# Altium project Testpoints.PrjPcb
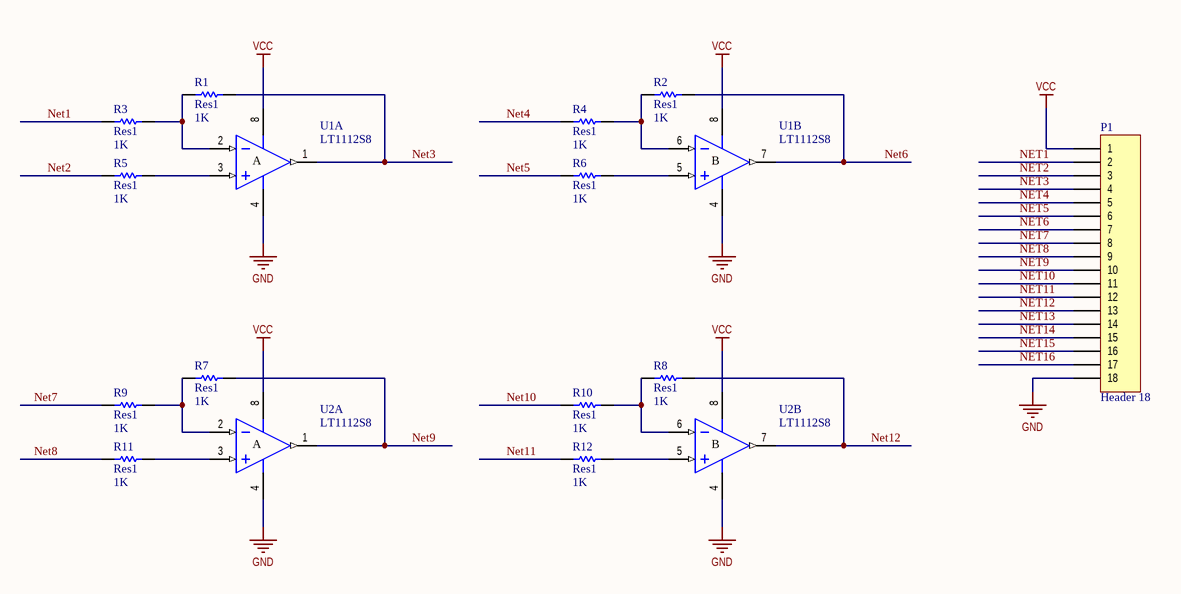
[diagram p0: Testpoints.SchDoc]
1 sheet, 15 parts. Net scope: global (net labels, ports and power ports of the same name join across sheets).
Board file: Testpoints.PcbDoc

## Sheet Testpoints.SchDoc: Testpoints
size 431 x 279 mm

### Parts
P1  Header 18  [HDR1X18]
R1  Res1  value 1K  [AXIAL-0.3]
R2  Res1  value 1K  [AXIAL-0.3]
R3  Res1  value 1K  [AXIAL-0.3]
R4  Res1  value 1K  [AXIAL-0.3]
R5  Res1  value 1K  [AXIAL-0.3]
R6  Res1  value 1K  [AXIAL-0.3]
R7  Res1  value 1K  [AXIAL-0.3]
R8  Res1  value 1K  [AXIAL-0.3]
R9  Res1  value 1K  [AXIAL-0.3]
R10  Res1  value 1K  [AXIAL-0.3]
R11  Res1  value 1K  [AXIAL-0.3]
R12  Res1  value 1K  [AXIAL-0.3]
U1  LT1112S8  [S8_N]  (parts A,B of 2)
U2  LT1112S8  [S8_N]  (parts A,B of 2)

### Nets
GND: P1.18 U1.4(V-) U2.4(V-)
VCC: P1.1 U1.8(V+) U2.8(V+)
Net1: P1.2 R3.1
Net2: P1.3 R5.1
Net3: P1.4 R1.2 U1.1(OUT)
Net4: P1.5 R4.1
Net5: P1.6 R6.1
Net6: P1.7 R2.2 U1.7(OUT)
Net7: P1.8 R9.1
Net8: P1.9 R11.1
Net9: P1.10 R7.2 U2.1(OUT)
Net10: P1.11 R10.1
Net11: P1.12 R12.1
Net12: P1.13 R8.2 U2.7(OUT)
NET13: P1.14
NET14: P1.15
NET15: P1.16
NET16: P1.17
NetR1_1: R1.1 R3.2 U1.2(IN-)
NetR2_1: R2.1 R4.2 U1.6(IN-)
NetR5_2: R5.2 U1.3(IN+)
NetR6_2: R6.2 U1.5(IN+)
NetR7_1: R7.1 R9.2 U2.2(IN-)
NetR8_1: R8.1 R10.2 U2.6(IN-)
NetR11_2: R11.2 U2.3(IN+)
NetR12_2: R12.2 U2.5(IN+)

### Notes on the sheet
- 8
- 7
- 6
- 5
- 4
- 3
- DWG. NO.
- REV.
- SHT.
- 2
- 1
- THIS DOCUMENT AND THE DATA DISCLOSED HEREIN OR HEREWITH IS THE PROPERTY OF ALTIUM LIMITED AND MAY BE FREELY DISTRIBUTED IN WHOLE. NO RIGHTS ARE RESERVED OR EXPRESS OR IMPLIED WARANTEE GIVEN.
- REVISION
- DESCRIPTION
- DATE
- APPROVED
- F
- E
- D
- C
- B
- ENG:
- APPROVALS
- PROJECT
- A
- DSN:
- CHK:
- REFERENCE DOCUMENTS
- PROJECT REVISION:
- TITLE
- DOCUMENT REVISION:
- DESIGN ITEM:
- BOM:
- FAB DWG:
- PCB DWG:
- ASSY DWG:
- SCALE:
- SIZE
- CAGE CODE
- FILE NAME
- DWG NO.
- SHEET
- OF
- REV
- (in symbol LT1112S8, part A) A
- (in symbol LT1112S8, part B) B

### Library data of the parts
P1 = Header 18: Header, 18-Pin; LatestRevisionDate: 17-Jul-2002; LatestRevisionNote: Re-released for DXP Platform.; Publisher: Altium Limited
R1-R12 = Res1: Resistor; Published: 8-Jun-2000; LatestRevisionDate: 17-Jul-2002; LatestRevisionNote: Re-released for DXP Platform.; PackageReference: AXIAL-0.3; Publisher: Altium Limited; PackageDescription: Axial Device, Thru-Hole; 2 Leads; 0.3 in Pin Spacing
U1 U2 = LT1112S8: Dual Low Power Precision, Picoamp Input Operational Amplifier; Note: 462; Published: 8-Jun-2000; LatestRevisionDate: 13-Apr-2006; LatestRevisionNote: IPC-7351 Footprint Added.; DatasheetVersion: 1996; PackageReference: S8; Publisher: Altium Limited; PackageDescription: 8-Pin Small Outline Integrated Circuit 1.27 mm Pitch; Code_JEDEC: MS-012-AA; Code_IPC: SOIC127P600-8; ComponentLink1Description: Manufacturer Link; ComponentLink1URL: http://www.linear.com/; ComponentLink2Description: Datasheet; ComponentLink2URL: http://www.linear.com/pc/downloadDocument.do?navId=H0,C1,C1154,C1009,C1100,P1365,D1714